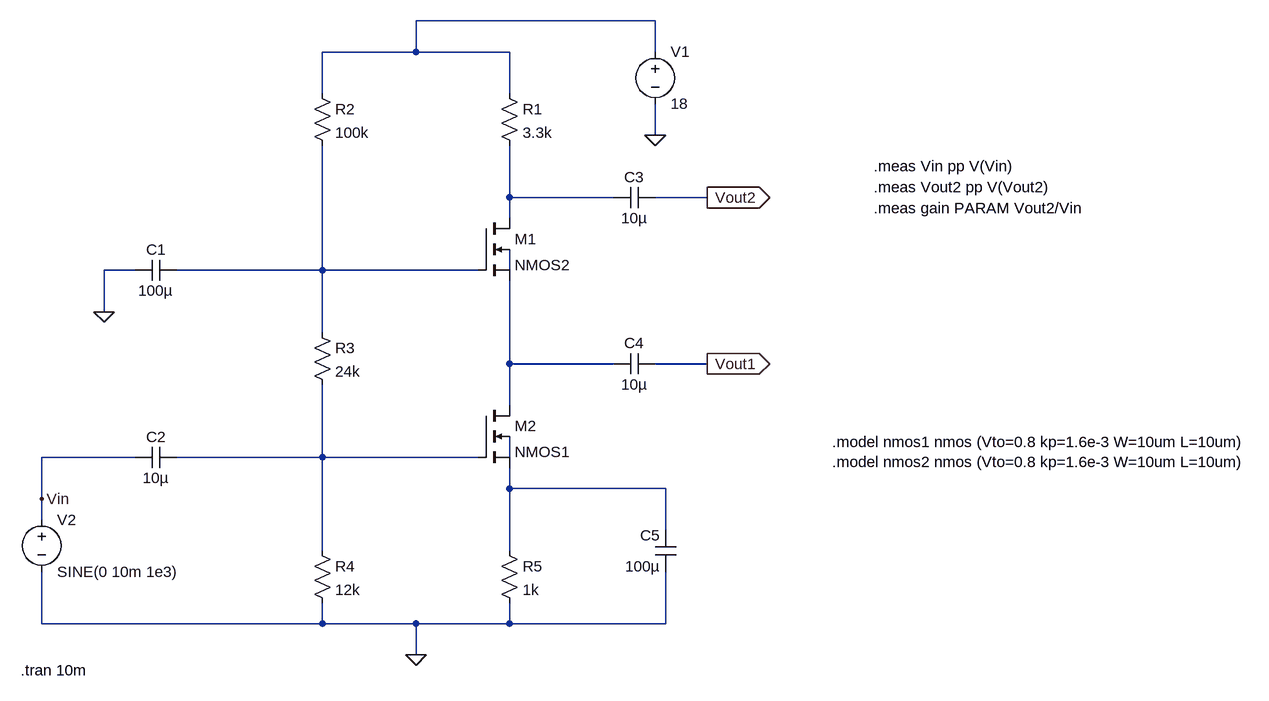
[diagram p0: schematic CASCODE AMPLIFIER.asc]
CASCODE AMPLIFIER.asc, the LTspice schematic file:
Version 4
SHEET 1 1280 680
WIRE 304 -464 -64 -464
WIRE -64 -416 -64 -464
WIRE -64 -416 -208 -416
WIRE 80 -416 -64 -416
WIRE 304 -416 304 -464
WIRE -208 -352 -208 -416
WIRE 80 -352 80 -416
WIRE 304 -288 304 -336
WIRE 80 -192 80 -272
WIRE 240 -192 80 -192
WIRE 384 -192 304 -192
WIRE 80 -160 80 -192
WIRE -496 -80 -544 -80
WIRE -208 -80 -208 -272
WIRE -208 -80 -432 -80
WIRE 32 -80 -208 -80
WIRE 80 -80 80 -112
WIRE -544 -16 -544 -80
WIRE -208 16 -208 -80
WIRE 80 64 80 -64
WIRE 240 64 80 64
WIRE 384 64 304 64
WIRE 80 128 80 64
WIRE -496 208 -640 208
WIRE -208 208 -208 96
WIRE -208 208 -432 208
WIRE 32 208 -208 208
WIRE 80 208 80 176
WIRE 80 256 80 224
WIRE 320 256 80 256
WIRE -640 272 -640 208
WIRE -640 304 -640 272
WIRE 320 320 320 256
WIRE -208 352 -208 208
WIRE 80 352 80 256
WIRE -640 464 -640 384
WIRE -208 464 -208 432
WIRE -208 464 -640 464
WIRE -64 464 -208 464
WIRE 80 464 80 432
WIRE 80 464 -64 464
WIRE 320 464 320 384
WIRE 320 464 80 464
WIRE -64 512 -64 464
FLAG -64 512 0
FLAG 304 -288 0
FLAG -544 -16 0
FLAG 384 64 Vout1
IOPIN 384 64 Out
FLAG 384 -192 Vout2
IOPIN 384 -192 Out
FLAG -640 272 Vin
SYMBOL nmos4 32 -160 R0
SYMATTR InstName M1
SYMATTR Value NMOS2
SYMBOL nmos4 32 128 R0
SYMATTR InstName M2
SYMATTR Value NMOS1
SYMBOL res 64 -368 R0
SYMATTR InstName R1
SYMATTR Value 3.3k
SYMBOL res -224 -368 R0
SYMATTR InstName R2
SYMATTR Value 100k
SYMBOL res -224 0 R0
SYMATTR InstName R3
SYMATTR Value 24k
SYMBOL res -224 336 R0
SYMATTR InstName R4
SYMATTR Value 12k
SYMBOL res 64 336 R0
SYMATTR InstName R5
SYMATTR Value 1k
SYMBOL voltage 304 -432 R0
WINDOW 123 0 0 Left 0
WINDOW 39 0 0 Left 0
SYMATTR InstName V1
SYMATTR Value 18
SYMBOL cap -432 -96 R90
WINDOW 0 0 32 VBottom 2
WINDOW 3 32 32 VTop 2
SYMATTR InstName C1
SYMATTR Value 100µ
SYMBOL cap -432 192 R90
WINDOW 0 0 32 VBottom 2
WINDOW 3 32 32 VTop 2
SYMATTR InstName C2
SYMATTR Value 10µ
SYMBOL cap 304 -208 R90
WINDOW 0 0 32 VBottom 2
WINDOW 3 32 32 VTop 2
SYMATTR InstName C3
SYMATTR Value 10µ
SYMBOL cap 304 48 R90
WINDOW 0 0 32 VBottom 2
WINDOW 3 32 32 VTop 2
SYMATTR InstName C4
SYMATTR Value 10µ
SYMBOL cap 336 384 R180
WINDOW 0 24 56 Left 2
WINDOW 3 24 8 Left 2
SYMATTR InstName C5
SYMATTR Value 100µ
SYMBOL voltage -640 288 R0
WINDOW 123 0 0 Left 0
WINDOW 39 0 0 Left 0
SYMATTR InstName V2
SYMATTR Value SINE(0 10m 1e3)
TEXT 576 184 Left 2 !.model nmos1 nmos (Vto=0.8 kp=1.6e-3 W=10um L=10um)\n.model nmos2 nmos (Vto=0.8 kp=1.6e-3 W=10um L=10um)
TEXT -672 536 Left 2 !.tran 10m
TEXT 640 -240 Left 2 !.meas Vin pp V(Vin)
TEXT 640 -208 Left 2 !.meas Vout2 pp V(Vout2)
TEXT 640 -176 Left 2 !.meas gain PARAM Vout2/Vin

The netlist it stands for:
* CASCODE AMPLIFIER.asc
M1 N002 N003 N005 N004 NMOS2
M2 N005 N006 N008 N007 NMOS1
R1 N001 N002 3.3k
R2 N001 N003 100k
R3 N003 N006 24k
R4 N006 0 12k
R5 N008 0 1k
V1 N001 0 18
C1 N003 0 100µ
C2 N006 Vin 10µ
C3 Vout2 N002 10µ
C4 Vout1 N005 10µ
C5 0 N008 100µ
V2 Vin 0 SINE(0 10m 1e3)
.model NMOS NMOS
.model PMOS PMOS
.lib standard.mos
.model nmos1 nmos (Vto=0.8 kp=1.6e-3 W=10um L=10um)
.model nmos2 nmos (Vto=0.8 kp=1.6e-3 W=10um L=10um)
.tran 10m
.meas Vin pp V(Vin)
.meas Vout2 pp V(Vout2)
.meas gain PARAM Vout2/Vin
.backanno
.end